# Altium schematic sheet +20_to_+5.schdoc
size A; SheetNumber: 2; SheetTotal: 5
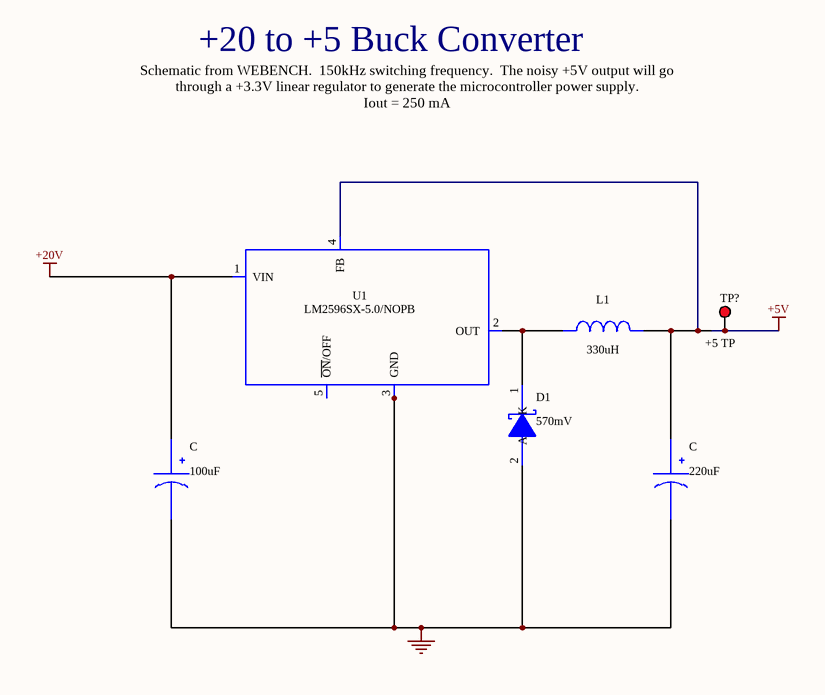
[diagram p0: +20_to_+5.schdoc]

## Parts
(Parts that share a designator on the sheet are numbered #1, #2 ... from top to bottom, then left to right.)
C#1  value 100uF  (hidden comment: EMVY500ADA101MHA0G)
C#2  value 220uF  (hidden comment: EEE-FC1H221P)
D1  value 570mV  (hidden comment: PMEG6010CEH,115)
L1  value 330uH  (hidden comment: NPI34W331MTRF)
TP?  +5 TP  [KSTN-5010_V]
U1  LM2596SX-5.0/NOPB

## Nets
0: C#1.2(-) C#2.2(-) D1.2(A) U1.3(GND) U1.6(TAB)
+5V: C#2.1(+) L1.2 TP?.1 U1.4(FB)
+20V: C#1.1(+) U1.1(VIN)
NetD1_1: D1.1(K) L1.1 U1.2(OUT)

Not connected (* = marked no-connect by the designer): U1 5(~{ON}/OFF)

## Notes on the sheet
- +20 to +5 Buck Converter
- Schematic from WEBENCH.  150kHz switching frequency.  The noisy +5V output will go through a +3.3V linear regulator to generate the microcontroller power supply.
  Iout = 250 mA

## Library data of the parts
C#1 = EMVY500ADA101MHA0G: EMVY500ADA101MHA; Manufacturer Name: Chemi-Con; PackageReference: EMVY500ADA101MHA0G; Manufacturer Part Number: EMVY500ADA101MHA0G
C#2 = EEE-FC1H221P: Manufacturer Name: Panasonic; PackageReference: EEE-FC1H221P; Manufacturer Part Number: EEE-FC1H221P
D1 = PMEG6010CEH,115: Manufacturer Name: Nexperia; PackageReference: PMEG6010CEH,115; Manufacturer Part Number: PMEG6010CEH,115
L1 = NPI34W331MTRF: Manufacturer Name: NIC Components; PackageReference: NPI34W331MTRF; Manufacturer Part Number: NPI34W331MTRF
TP? = CMP-1672-00002-4: Test Point, Red, Through Hole, RoHS, Bulk; Manufacturer: Keystone; Contact Material: Bronze; Mounting Technology: Through Hole; RoHSCompliant: true; Pins: 1; Package Quantity: 100; ComponentLink2Description: Datasheet; Height: 8.12 mm; ComponentLink1URL: http://www.keyelco.com/; DatasheetVersion: Rev. F, 12/2013; Mount: Through Hole; PackageReference: 5010; Contact Plating: Silver; Packaging: Bulk; Colour: Red; REACH SVHC: No SVHC; PackageDescription: 1-Pin Through Hole Device, Dia 3.17 mm; ComponentLink2URL: http://www.keyelco.com/product-pdf.cfm?p=1319; ComponentLink1Description: Manufacturer URL
U1 = LM2596SX-5.0/NOPB: LM2596SX-5.0/NOP; Manufacturer Name: Texas Instruments; PackageReference: LM2596SX-5.0/NOPB; Manufacturer Part Number: LM2596SX-5.0/NOPB; Value: N/A